# Altium schematic sheet digital_measurer.SchDoc
size B
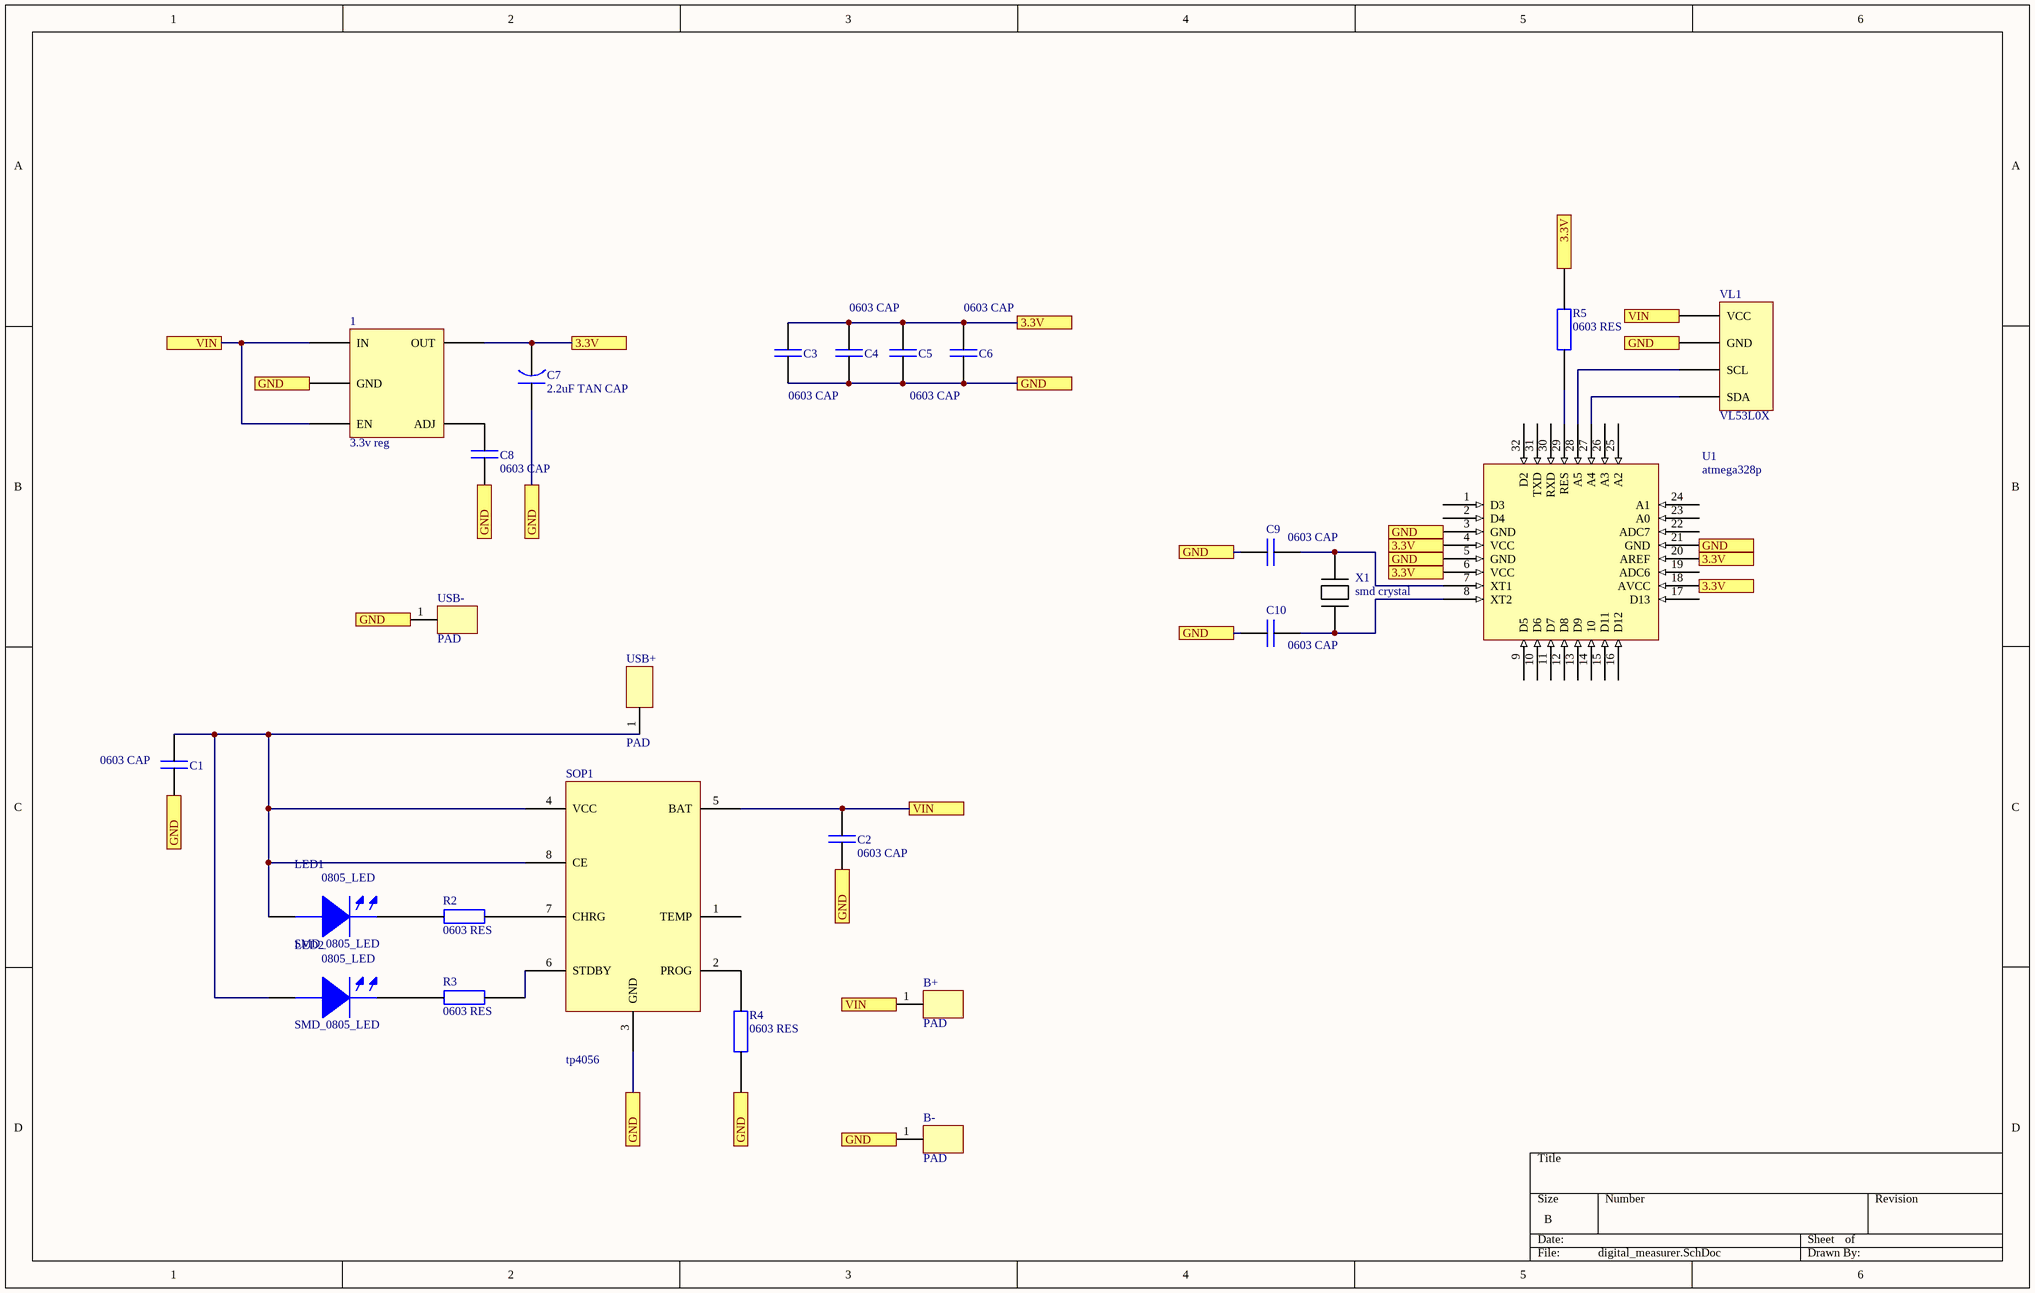
[diagram p0: digital_measurer.SchDoc]

## Parts
1  3.3v reg  [3.3v reg]
B+  PAD  [PAD]
B-  PAD  [PAD]
C1  0603 CAP  [0603 CAP]
C2  0603 CAP  [0603 CAP]
C3  0603 CAP  [0603 CAP]
C4  0603 CAP  [0603 CAP]
C5  0603 CAP  [0603 CAP]
C6  0603 CAP  [0603 CAP]
C7  2.2uF TAN CAP  [2.2uF TAN CAP]
C8  0603 CAP  [0603 CAP]
C9  0603 CAP  [0603 CAP]
C10  0603 CAP  [0603 CAP]
LED1  SMD_0805_LED  [0805_LED]
LED2  SMD_0805_LED  [0805_LED]
R2  0603 RES  [0603 RES]
R3  0603 RES  [0603 RES]
R4  0603 RES  [0603 RES]
R5  0603 RES  [0603 RES]
SOP1  tp4056  [tp4056]
U1  atmega328p  [atmega328p]
USB+  PAD  [PAD]
USB-  PAD  [PAD]
VL1  VL53L0X  [VL53L0x]
X1  smd crystal  [smd crystal]

## Ports
3.3V, GND, VIN

## Nets
3.3V: 1.5(OUT) C3.2 C4.2 C5.2 C6.2 C7.2 R5.1 U1.4(VCC) U1.6(VCC) U1.18(AVCC) U1.20(AREF) ; port 3.3V
GND: 1.2(GND) B-.1 C1.1 C2.1 C3.1 C4.1 C5.1 C6.1 C7.1 C8.1 C9.1 C10.1 R4.1 SOP1.3(GND) U1.3(GND) U1.5(GND) U1.21(GND) USB-.1 VL1.2(GND) ; port GND
VIN: 1.1(IN) 1.3(EN) B+.1 C2.2 SOP1.5(BAT) VL1.1(VCC) ; port VIN
Net1_4: 1.4(ADJ) C8.2
NetC1_2: C1.2 LED1.1 LED2.1 SOP1.4(VCC) SOP1.8(CE) USB+.1
NetC9_2: C9.2 U1.7(XT1) X1.3
NetC10_2: C10.2 U1.8(XT2) X1.1
NetLED1_2: LED1.2 R2.1
NetLED2_2: LED2.2 R3.1
NetR2_2: R2.2 SOP1.7(CHRG)
NetR3_2: R3.2 SOP1.6(STDBY)
NetR4_2: R4.2 SOP1.2(PROG)
NetR5_2: R5.2 U1.29(RES)
NetU1_27: U1.27(A4) VL1.4(SDA)
NetU1_28: U1.28(A5) VL1.3(SCL)

Not connected (* = marked no-connect by the designer): SOP1 1(TEMP); U1 1(D3) 2(D4) 9(D5) 10(D6) 11(D7) 12(D8) 13(D9) 14(10) 15(D11) 16(D12) 17(D13) 19(ADC6) 22(ADC7) 23(A0) 24(A1) 25(A2) 26(A3) 30(RXD) 31(TXD) 32(D2)

## Notes on the sheet
- (in symbol SMD_0805_LED) 0805_LED